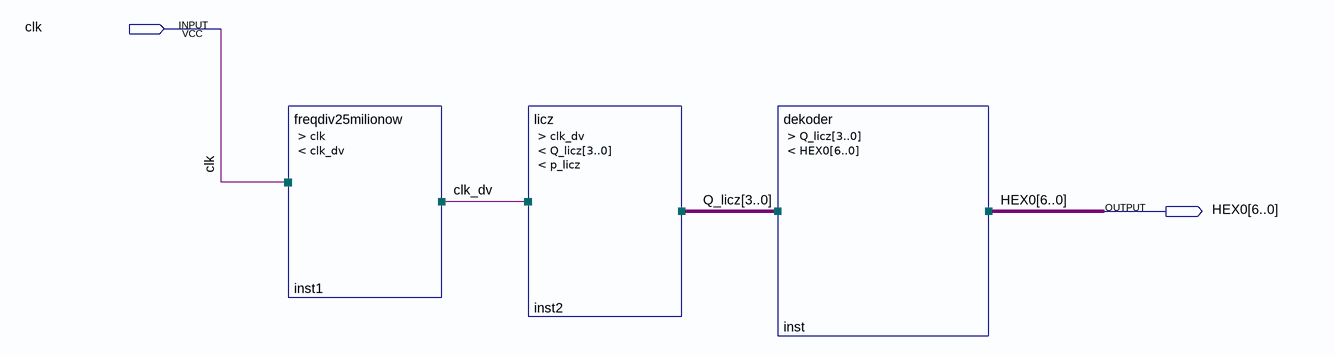
[diagram p0: schematic sheet]
// Quartus schematic proj.bdf as structural Verilog: 3 symbols, 2 pins
module proj (
  input  clk,
  output [6:0] HEX0
);

  wire clk_dv;
  wire [3:0] Q_licz;

  freqdiv25milionow inst1 (.clk(clk), .clk_dv(clk_dv));
  licz inst2 (.clk_dv(clk_dv), .Q_licz(Q_licz));  // open: p_licz
  dekoder inst (.Q_licz(Q_licz), .HEX0(HEX0));
endmodule
